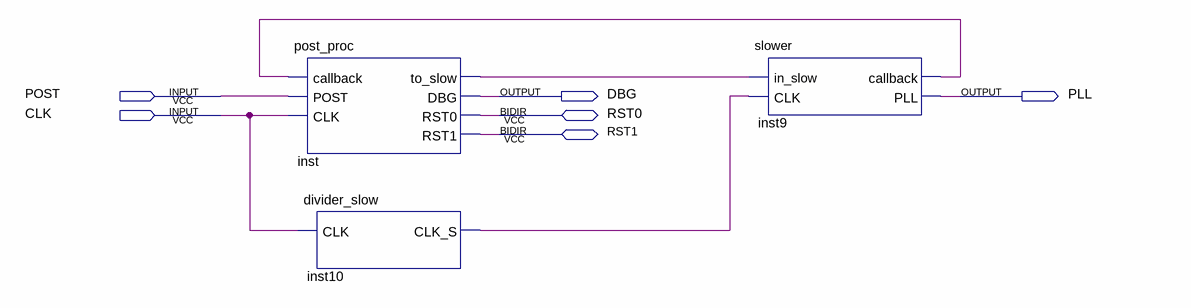
[diagram p0: schematic sheet]
// Quartus schematic glitchChip.bdf as structural Verilog: 3 symbols, 6 pins
module glitchChip (
  input  POST,
  input  CLK,
  inout  RST0,
  inout  RST1,
  output DBG,
  output PLL
);

  wire inst9_callback, inst10_clk_s, inst_to_slow;

  post_proc inst (
    .callback(inst9_callback), .POST(POST), .CLK(CLK), .to_slow(inst_to_slow), .DBG(DBG), .RST0(RST0),
    .RST1(RST1));
  divider_slow inst10 (.CLK(CLK), .CLK_S(inst10_clk_s));
  slower inst9 (.in_slow(inst_to_slow), .CLK(inst10_clk_s), .callback(inst9_callback), .PLL(PLL));
endmodule
